# Altium schematic sheet Constant Current Sink.SchDoc
size A4; SheetNumber: 3; SheetTotal: 8
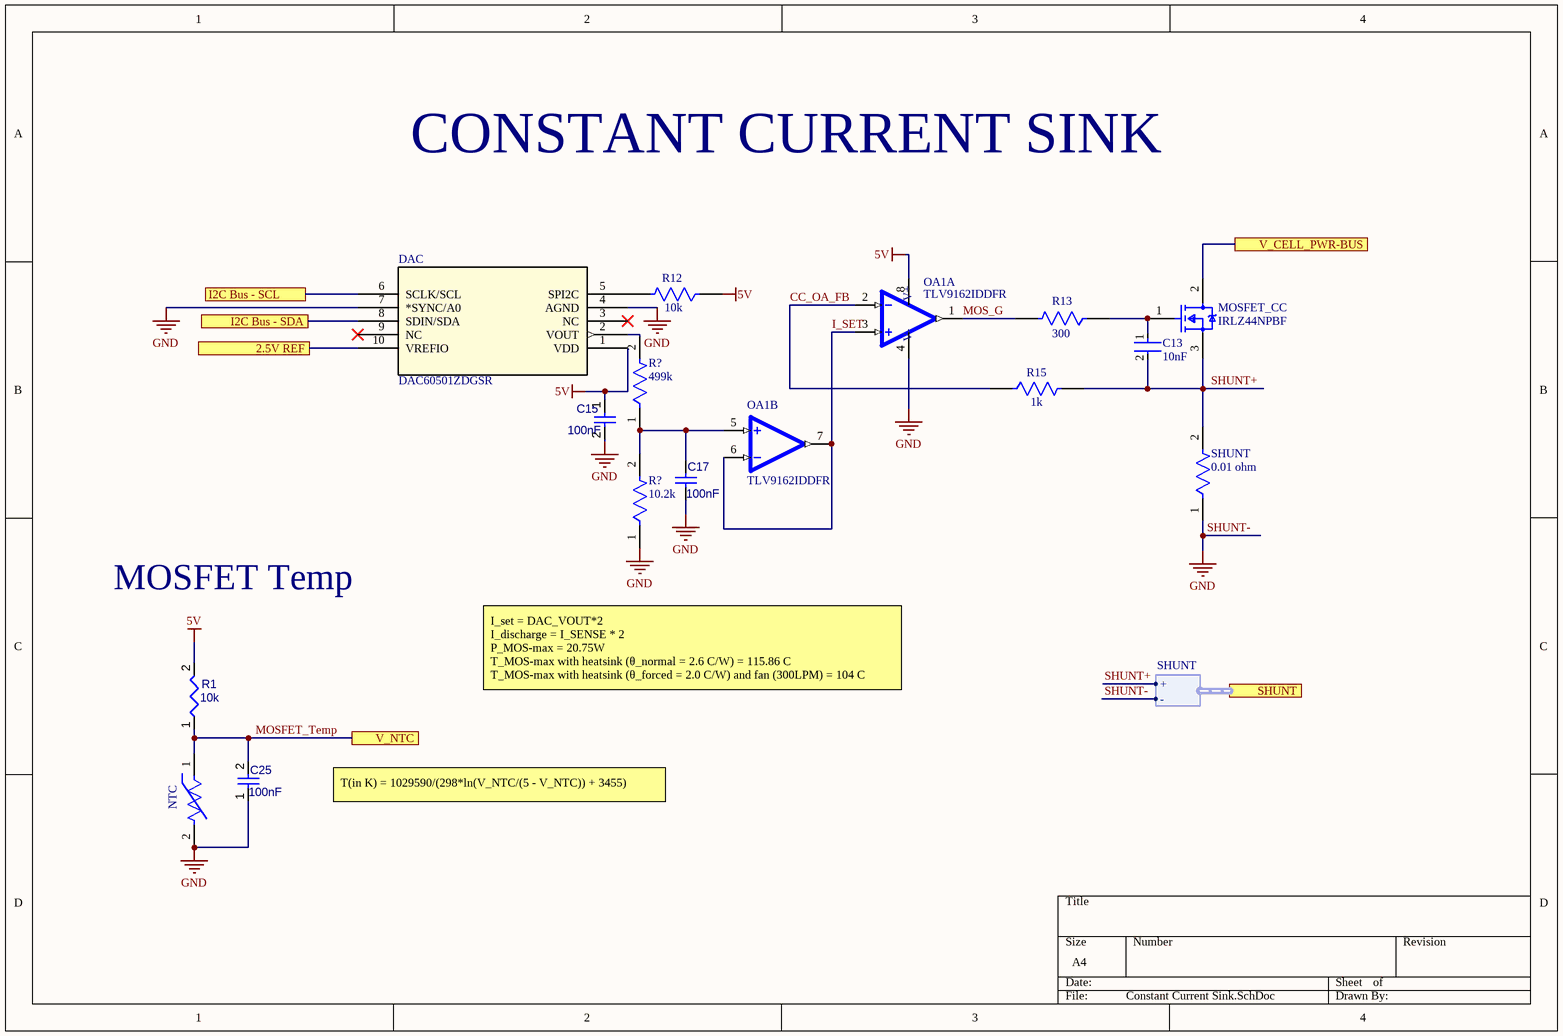
[diagram p0: Constant Current Sink.SchDoc]

## Parts
(Parts that share a designator on the sheet are numbered #1, #2 ... from top to bottom, then left to right.)
C13  10nF  [FP-GCM219-0_15-IPC_C]
C15  100nF  [CAPC2013X95X50LL10T25]
C17  100nF  [CAPC2013X95X50LL10T25]
C25  100nF  [CAPC2013X95X50LL10T25]
DAC  DAC60501ZDGSR  [DGS10_TEX]
MOSFET_CC  IRLZ44NPBF  [FP-PG-TO220-3-MFG]
NTC  NXRT15XH103FA1B030  [FP-NXR_151B030-MFG]  (value not drawn)
OA1  TLV9162IDDFR  [SOT65P280X110-8N]  (parts A,B of 2)
R1  10k  [RESC2013X50X35ML15T15]
R12  10k  [FP-AC0603-IPC_A]
R13  300  [FP-CR0805-MFG]
R15  1k  [FP-RN73R2A-IPC_A]
R?#1  499k  [FP-RQ732B-IPC_C]
R?#2  10.2k  [FP-RT1206-MFG]
SHUNT  0.01 ohm  [FP-PA2512E-R007-0R10-MFG]

## Ports
2.5V REF, I2C Bus - SCL, I2C Bus - SDA, SHUNT (harness SHUNT), V_CELL_PWR-BUS, V_NTC

## Harnesses
SHUNT: +, -

## Nets
5V: C15.1 DAC.1(VDD) OA1.8(V+) R1.2 R12.1
SHUNT-: C15.2 C17.2 C25.1 DAC.4(AGND) DAC.7(*SYNC/A0) NTC.2 OA1.4(V-) R?#2.1 SHUNT.1 ; port SHUNT.-  [also labelled GND]
2.5V REF: DAC.10(VREFIO) ; port 2.5V REF
CC_OA_FB: OA1.2(IN1-) R15.1
I2C Bus - SCL: DAC.6(SCLK/SCL) ; port I2C Bus - SCL
I2C Bus - SDA: DAC.8(SDIN/SDA) ; port I2C Bus - SDA
I_SET: OA1.3(IN1+) OA1.6(IN2-) OA1.7(OUT2)
MOS_G: OA1.1(OUT1) R13.2
MOSFET_Temp: C25.2 NTC.1 R1.1 ; port V_NTC
SHUNT+: C13.2 MOSFET_CC.3(S) R15.2 SHUNT.2 ; port SHUNT.+
V_CELL_PWR-BUS: MOSFET_CC.2(D) ; port V_CELL_PWR-BUS
NetC13_1: C13.1 MOSFET_CC.1(G) R13.1
NetC17_1: C17.1 OA1.5(IN2+) R?#1.1 R?#2.2
NetDAC_2: DAC.2(VOUT) R?#1.2
NetDAC_5: DAC.5(SPI2C) R12.2

Not connected (* = marked no-connect by the designer): DAC 3(NC)* 9(NC)*

## Notes on the sheet
- CONSTANT CURRENT SINK
- MOSFET Temp
- I_set = DAC_VOUT*2
  I_discharge = I_SENSE * 2
  P_MOS-max = 20.75W
  T_MOS-max with heatsink (θ_normal = 2.6 C/W) = 115.86 C
  T_MOS-max with heatsink (θ_forced = 2.0 C/W) and fan (300LPM) = 104 C
- T(in K) = 1029590/(298*ln(V_NTC/(5 - V_NTC)) + 3455)

## Library data of the parts
C13 = CMP-06035-023057-1: Ceramic Capacitor for Automotive 10nF  ±10% 100VDC X8R 0805 Paper T/R
C15 C17 C25 = CMP-001-00018-6: Capacitor 100 nF +/-10% 50 V 0805; Voltage Rating: 50V; Tolerance: 10%; Capacitor Type: Ceramic; Value: 100nF; Pins: 2; Max Operating Temperature: 125°C; Min Operating Temperature: -55°C; Mounting Technology: SM; Case/Package: 0805; RoHS Compliant: True
DAC = DAC60501ZDGSR: True 12-bit, 1-ch, SPI/I2C, voltage-output DAC in WSON package with precision internal reference 10-VSSOP -40 to 125; Manufacturer_Name: Texas Instruments; Copyright: Copyright (C) 2025 Ultra Librarian. All rights reserved.; Manufacturer_Part_Number: DAC60501ZDGSR; RefDes: RefDes; Type: Type
MOSFET_CC = CMP-32901-000488-1: MOSFET N-CH 55V 47A TO220AB; Turn-On Delay Time: 11ns; Gate to Source Voltage (Vgs): 16V; Element Configuration: Single; Rds On Max: 22mR; Turn-Off Delay Time: 26ns; Max Power Dissipation: 110W; Threshold Voltage: 2V; Drain to Source Resistance: 35mR; Input Capacitance: 1.7nF; Continuous Drain Current (ID): 47A; Case/Package: TO-220; Lead Free: Lead Free; Halogen Free: Halogen Free; Packaging: Rail/Tube; Length: 0.414inch; Min Operating Temperature: -55°C; REACH SVHC: No SVHC; Number of Pins: 3; Width: 0.185inch; Drain to Source Voltage (Vdss): 55V; Power Dissipation: 110W; RoHS Compliant: Yes; Max Operating Temperature: 175°C; Height: 0.6inch; Max Dual Supply Voltage: 55V; Drain to Source Breakdown Voltage: 55V; Mount: Through Hole
NTC = CMP-06022-001050-1: Thermistor NTC 10kΩ ±1% 2-Pin Radial Bulk; Resistance: 10kR; Max Power Dissipation: 7.5mW; Lead Diameter: 0.4mm; RoHS Compliant: Yes; Number of Pins: 2; Lead Free: Lead Free; Height: 2mm; Lead Pitch: 2.5mm; Power Rating: 7.5mW; Series: NXR; Packaging: Bulk; Package Quantity: 500; Width: 4mm; Max Operating Temperature: 125°C; Termination: Radial; Min Operating Temperature: -40°C; Tolerance: 1%; Resistance Tolerance: 1%; Length: 5mm; Mount: Through Hole
OA1 = CMP-014-00004-1: Dual, 16V, 11MHz, rail-to-rail input and output low-offset-voltage low-noise operational amplifier; MF: Texas Instruments; SnapEDA_Link: https://www.snapeda.com/parts/TLV9162IDDFR/Texas+Instruments/view-part/?ref=snap; Case/Package: SOT-23-THN-8 Texas Instruments; Component Type: Standard; Design Item ID: TLV9162IDDFR; MP: TLV9162IDDFR; Pins: 8; Source: TLV9162IDDFR.SchLib; Check_prices: https://www.snapeda.com/parts/TLV9162IDDFR/Texas+Instruments/view-part/?ref=eda; Value: *
R1 = CMP-009-00018-5: Chip Resistor, 10 KOhm, +/- 1%, 125 mW, -55 to 155 degC, 0805 (2012 Metric); Power: 125mW; Voltage Rating: 150V; Tolerance: 1%; Pins: 2; Min Operating Temperature: -55°C; Case/Package: 0805; Max Operating Temperature: 155°C; RoHS Compliant: True; Mounting Technology: SM
R12 = CMP-03412-040683-1: RES 10kΩ 5.00% 0.2W 0603
R13 = CMP-07231-003646-1: CR0805-FX-3000ELF Thick Film Chip Resistors 0805 300Ω 0.125W 1% 100ppm/°C; Max Power Dissipation: 125mW; Voltage Rating: 150V; Resistance: 300R; Contact Plating: Tin; Number of Terminations: 2; Termination: SMD/SMT; Case Code (Imperial): 0805; Mount: Surface Mount; Length: 2mm; Thickness: 508um; Package Quantity: 1; Case Code (Metric): 2012; Width: 1.25mm; Military Standard: Not; Max Operating Temperature: 155°C; Temperature Coefficient: 100ppm/°C; Min Operating Temperature: -55°C; Features: Moisture Resistant; Radiation Hardening: No; Composition: Thick Film; Height: 0.024inch; Power Rating: 125mW; Depth: 1.25mm; Tolerance: 1%; Packaging: Tape and Reel; Case/Package: 0805
R15 = CMP-04015-026717-1: RN73R2ATTD1001B10 1kΩ ±0.1% 0.125W, 1/8W Chip Resistor 0805 (2012 Metric) Moisture Resistant Thin Film
R?#1 = CMP-03211-002016-1: RQ732B 1206 499KΩ 0.4W 10ppm/°C 0.1% 200V; Manufacturer: TE; Manufacturer Part Number: RQ73C2B499KBTD; Automotive Grade: Grade 0; Device Class L2: Resistors; Height: 0.75mm; Tolerance: 0.1%; Octopart: https://octopart.com/5-2176392-6-te+connectivity-93905009; ComponentLink2Description: Datasheet; Lead Free: Yes; Temperature Range High: +155°C; RoHS: TRUE; Category: Res; Voltage Rating: 200V; Temperature Coefficient: 10ppm/°C; Package: RQ732B; Power Rating: 0.4W; Device Class L1: Passive Components; Device Class L3: Chip SMD Resistors; ComponentLink2URL: https://www.te.com/commerce/DocumentDelivery/DDEController?Action=showdoc&DocId=Data+Sheet%7F1773270-2%7FA%7Fpdf%7FEnglish%7FENG_DS_1773270-2_A.pdf%7F9-2176388-657; Temperature: -55°C to +155°C; Value: 499KΩ; Ipc Land Pattern Name: RESC310160X60; Resistance: 499KΩ; Composition: Thin Film; Temperature Range Low: -55°C; Series: RQ73; Automotive: Yes
R?#2 = CMP-2003-04153-2: RES SMD 10.2K OHM 1% 1/4W 1206; Manufacturer Part Number: RT1206FRE0710K2L; Manufacturer: Yageo; Resistance: 10.2KΩ; Value: 10.2KΩ; Description: RT1206 10.2KΩ 0.25W 50 ppm/°C 0.02%; Temperature Coefficient: 50 ppm/°C; Power Rating: 0.25W; Voltage Rating: 200V; Tolerance: 0.0002; Automotive: No; Device Class L2: Resistors; Device Class L1: Passive Components; Lead Free: Yes; Series: RT; RoHS: TRUE; Device Class L3: Chip SMD Resistors; Footprint Url: http://www.yageo.com/exep/pages/download/literatures/PYu-R_Mount_10.pdf; Ipc Land Pattern Name: RESC310160X55; Mouser Description: Thin Film Resistors - SMD 1/4W 10.2K ohm 1% 50ppm; Temperature Range High: +155°C; ComponentLink2Description: Datasheet; Height: 0.65mm; Temperature Range Low: -55°C; Octopart: https://octopart.com/rt1206fre0710k2l-yageo-1255827; Category: Res; Package: RT1206; Temperature: -55°C to +155°C; ComponentLink2URL: http://www.yageo.com/documents/recent/PYu-RT_1-to-0.01_RoHS_L_9.pdf; Composition: Thin Film; Digikey Description: RES SMD 10.2K OHM 1% 1/4W 1206
SHUNT = CMP-03412-024797-1: METAL CURRENT SENSOR 2512 1% 50P; Manufacturer: Yageo; Manufacturer Part Number: PA2512FKE7W0R01E; Value: 10mΩ; Temperature Coefficient: 50ppm/°C; Automotive Grade: Grade 0; Description: 10 mOhms ±1% 2W Chip Resistor 2512 (6432 Metric) Automotive AEC-Q200, Current Sense, Moisture Resistant Metal Element; Power Rating: 2W; Automotive: Yes; Series: PA_E; Height: 0.88mm; Category: Res; Temperature Range Low: -55°C; Ipc Land Pattern Name: RESC635318X63; Device Class L3: Chip SMD Resistors; ComponentLink2URL: http://www.yageo.com/documents/recent/PYu-PA_E_51_RoHS_10.pdf; Composition: Metal Element; Device Class L1: Passive Components; ComponentLink2Description: Datasheet; Resistance: 10mΩ; Package: PA2512E-R007-0R10; Digikey Description: METAL CURRENT SENSOR 2512 1% 50P; Temperature Range High: +170°C; Octopart: https://octopart.com/pa2512fke7w0r01e-yageo-85405230; Device Class L2: Resistors; Temperature: -55°C to +170°C; Lead Free: Yes; Tolerance: 1%; RoHS: TRUE